# EAGLE schematic serialconnection (EAGLE 9.6.2)
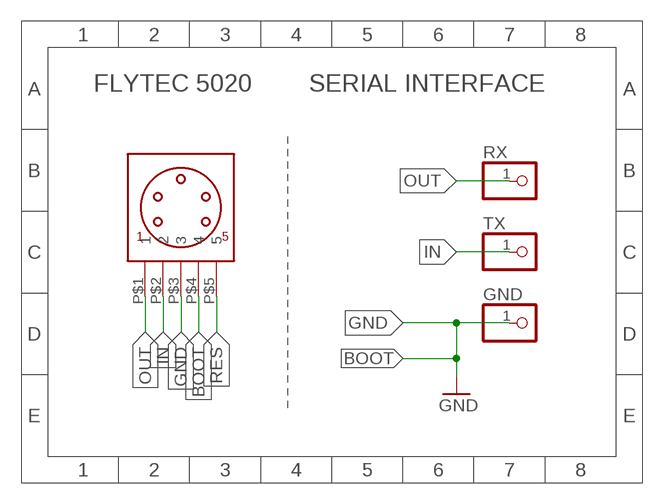
[diagram p0: schematic, sheet 1]

## Parts
GND  PINHD-1X1  [1X01]
RX  PINHD-1X1  [1X01]
TX  PINHD-1X1  [1X01]
U$1  SERIAL_CONNECTOR  [SERIAL_CONNECTOR]

## Nets
BOOT: U$1.P$4
GND: GND.1 U$1.P$3
IN: TX.1 U$1.P$2
OUT: RX.1 U$1.P$1
RES: U$1.P$5

## Notes on the sheet
- FLYTEC 5020 | SERIAL INTERFACE
- BOOT

## Library data of the parts
GND RX TX = pinhead:PINHD-1X1: PIN HEADER
U$1 = flytec5020:SERIAL_CONNECTOR